# Altium schematic sheet Display.SchDoc
size A2
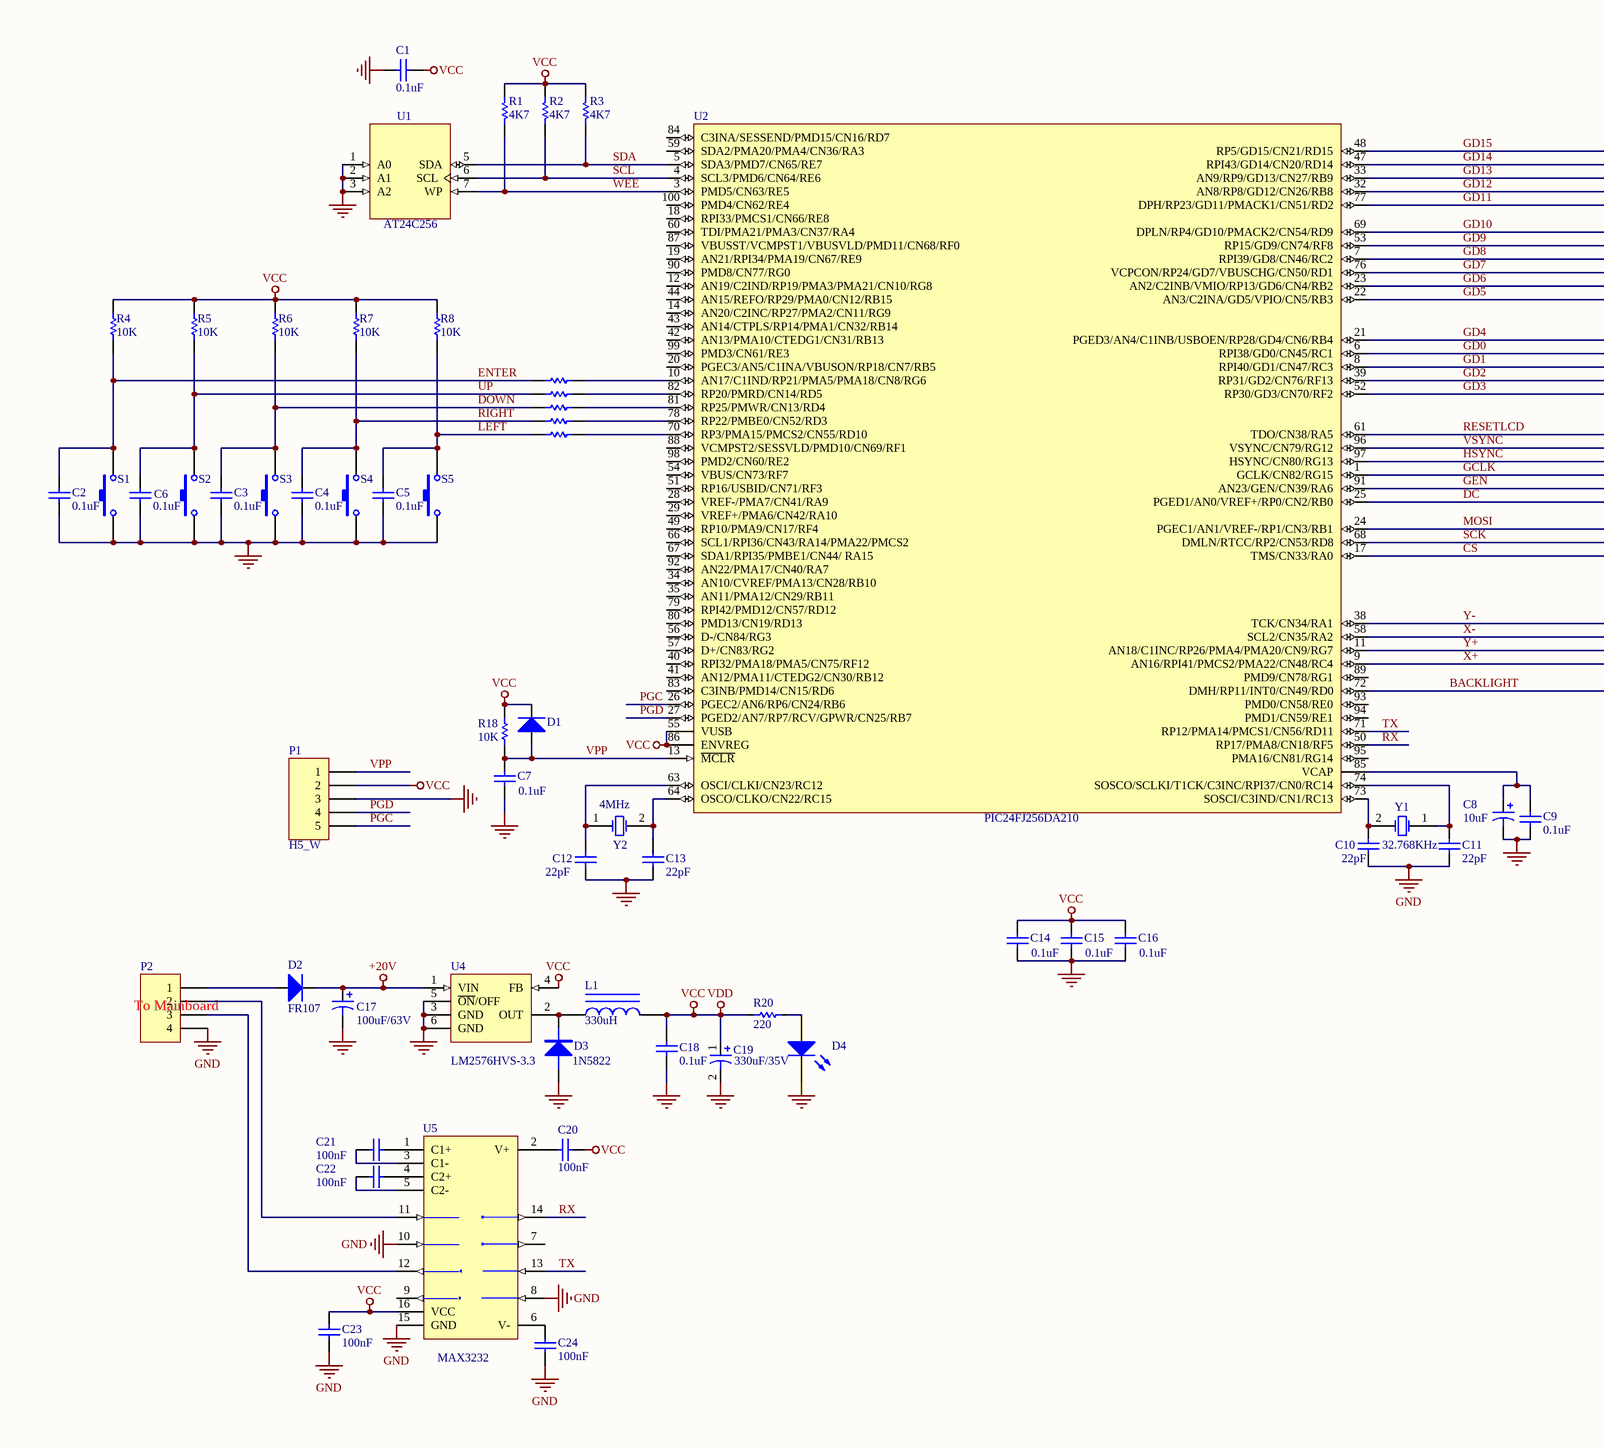
[diagram p0: Display.SchDoc, left]
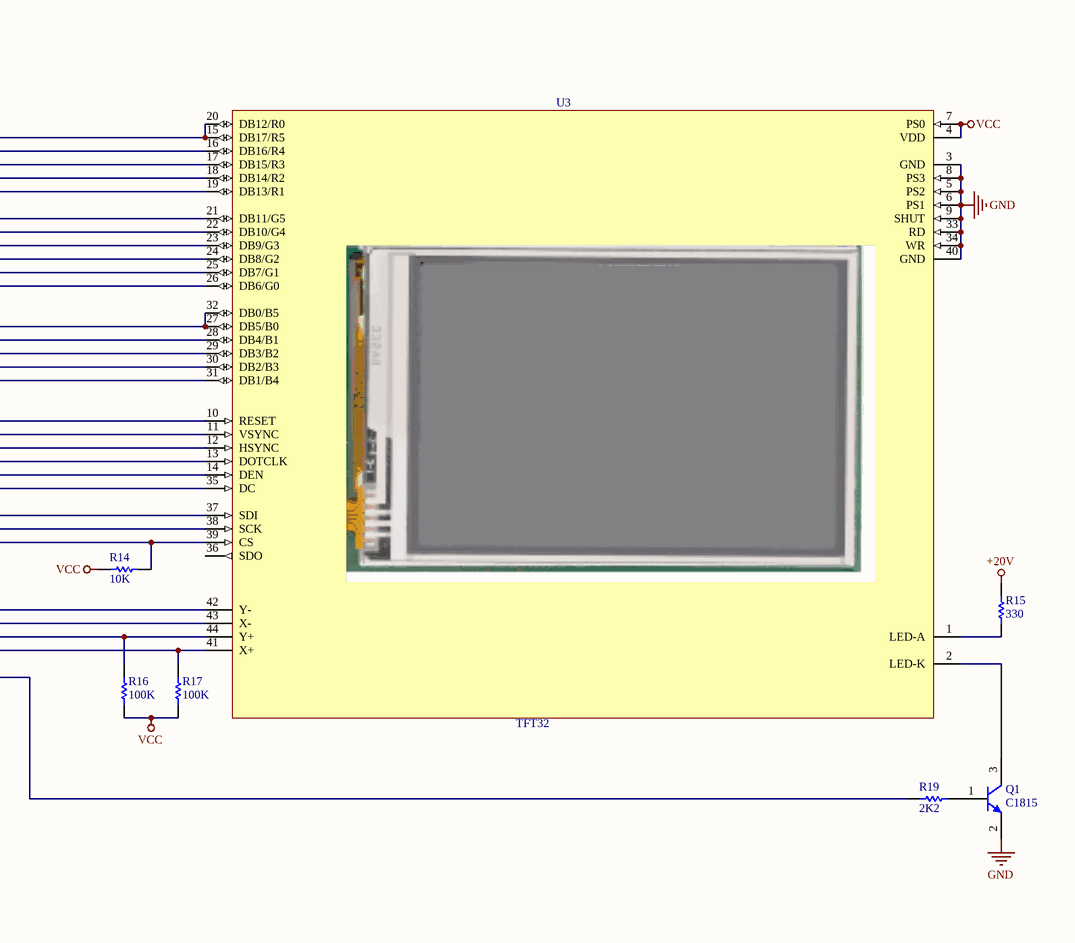
[diagram p1: Display.SchDoc, right]

## Parts
C1  0.1uF  [C1206]
C2  0.1uF  [C1206]
C3  0.1uF  [C1206]
C4  0.1uF  [C1206]
C5  0.1uF  [C1206]
C6  0.1uF  [C1206]
C7  0.1uF  [C1206]
C8  10uF  [C106-SMD]
C9  0.1uF  [C1206]
C10  22pF  [C0805]
C11  22pF  [C0805]
C12  22pF  [C0805]
C13  22pF  [C0805]
C14  0.1uF  [C1206]
C15  0.1uF  [C1206]
C16  0.1uF  [C1206]
C17  100uF/63V  [CAP-100UF/63V]
C18  value 0.1uF  [C1206]  (hidden comment: 104)
C19  330uF/35V  [CAP-100UF/63V]
C20  100nF  [C1206]
C21  100nF  [C1206]
C22  100nF  [C1206]
C23  100nF  [C1206]
C24  100nF  [C1206]
D1  1N4148  [1N4148-SMD]  (value not drawn)
D2  FR107  [DIODE-1A/300]
D3  1N5822  [FR307]
D4  LED  [LED-1206/100x100]  (value not drawn)
L1  330uH  [L-330uH]
P1  H5_W  [HEADER 5B]
P2  Header 4  [HEADER4X]  (value not drawn)
Q1  C1815  [SOT23A]
R1  4K7  [R0805]
R2  4K7  [R0805]
R3  4K7  [R0805]
R4  10K  [R0805]
R5  10K  [R0805]
R6  10K  [R0805]
R7  10K  [R0805]
R8  10K  [R0805]
R9  220  [R0805]  (value not drawn)
R10  220  [R0805]  (value not drawn)
R11  220  [R0805]  (value not drawn)
R12  220  [R0805]  (value not drawn)
R13  220  [R0805]  (value not drawn)
R14  10K  [R0805]
R15  330  [R1206]
R16  100K  [R0805]
R17  100K  [R0805]
R18  10K  [R0805]
R19  2K2  [R0805]
R20  220  [R0805]
S1  SW-PB  [BUTON-B3F]  (value not drawn)
S2  SW-PB  [BUTON-B3F]  (value not drawn)
S3  SW-PB  [BUTON-B3F]  (value not drawn)
S4  SW-PB  [BUTON-B3F]  (value not drawn)
S5  SW-PB  [BUTON-B3F]  (value not drawn)
U1  AT24C256  [8-SOIC_751]
U2  PIC24FJ256DA210  [TQFP-PT100_M]
U3  TFT32  [TFT-32]
U4  value LM2576HVS-3.3  [LM2576HVS-SMT]  (hidden comment: LM2576D2T-3.3)
U5  MAX3232  [NSO16_N]
Y1  32.768KHz  [XTA-32.768K]
Y2  4MHz  [XTA_SMD]

## Nets
+20V: C17.1 D2.2(K) R15.2 U4.1(VIN)
GND: C1.1 C2.1 C3.1 C4.1 C5.1 C6.1 C7.2 C8.2 C9.2 C10.1 C11.1 C12.1 C13.1 C14.2 C15.2 C16.2 C17.2 C18.1 C19.2 C23.2 C24.2 D3.1(A) D4.2(K) P1.3 P2.4 Q1.2(E) S1.1 S2.1 S3.1 S4.1 S5.1 U1.1(A0) U1.2(A1) U1.3(A2) U1.4(VSS) U2.15(VSS) U2.31(AVSS) U2.36(VSS) U2.45(VSS) U2.65(VSS) U2.75(VSS) U3.3(GND) U3.5(PS2) U3.6(PS1) U3.8(PS3) U3.9(SHUT) U3.33(RD) U3.34(WR) U3.40(GND) U4.3(GND) U4.5(~{ON}/OFF) U4.6(GND) U5.8(R2IN) U5.10(T2IN) U5.15(GND)
VCC: C1.2 C14.1 C15.1 C16.1 C18.2 C19.1 C20.2 C23.1 D1.2(K) L1.2 P1.2 R1.1 R2.1 R3.1 R4.2 R5.2 R6.2 R7.2 R8.2 R14.1 R16.1 R17.1 R18.1 R20.2 U1.8(VCC) U2.2(VDD) U2.16(VDD) U2.30(AVDD) U2.37(VDD) U2.46(VDD) U2.55(VUSB) U2.62(VDD) U2.86(ENVREG) U3.4(VDD) U3.7(PS0) U4.4(FB) U5.16(VCC)  [also labelled VDD]
BACKLIGHT: R19.2 U2.72(DMH/RP11/INT0/CN49/RD0)
CS: R14.2 U2.17(TMS/CN33/RA0) U3.39(CS)
DC: U2.25(PGED1/AN0/VREF+/RP0/CN2/RB0) U3.35(DC)
DOWN: C3.2 R6.1 R11.2 S3.2
ENTER: C2.2 R4.1 R9.2 S1.2
GCLK: U2.1(GCLK/CN82/RG15) U3.13(DOTCLK)
GD0: U2.6(RPI38/GD0/CN45/RC1) U3.28(DB4/B1)
GD1: U2.8(RPI40/GD1/CN47/RC3) U3.29(DB3/B2)
GD2: U2.39(RP31/GD2/CN76/RF13) U3.30(DB2/B3)
GD3: U2.52(RP30/GD3/CN70/RF2) U3.31(DB1/B4)
GD4: U2.21(PGED3/AN4/C1INB/USBOEN/RP28/GD4/CN6/RB4) U3.27(DB5/B0) U3.32(DB0/B5)
GD5: U2.22(AN3/C2INA/GD5/VPIO/CN5/RB3) U3.26(DB6/G0)
GD6: U2.23(AN2/C2INB/VMIO/RP13/GD6/CN4/RB2) U3.25(DB7/G1)
GD7: U2.76(VCPCON/RP24/GD7/VBUSCHG/CN50/RD1) U3.24(DB8/G2)
GD8: U2.7(RPI39/GD8/CN46/RC2) U3.23(DB9/G3)
GD9: U2.53(RP15/GD9/CN74/RF8) U3.22(DB10/G4)
GD10: U2.69(DPLN/RP4/GD10/PMACK2/CN54/RD9) U3.21(DB11/G5)
GD11: U2.77(DPH/RP23/GD11/PMACK1/CN51/RD2) U3.19(DB13/R1)
GD12: U2.32(AN8/RP8/GD12/CN26/RB8) U3.18(DB14/R2)
GD13: U2.33(AN9/RP9/GD13/CN27/RB9) U3.17(DB15/R3)
GD14: U2.47(RPI43/GD14/CN20/RD14) U3.16(DB16/R4)
GD15: U2.48(RP5/GD15/CN21/RD15) U3.15(DB17/R5) U3.20(DB12/R0)
GEN: U2.91(AN23/GEN/CN39/RA6) U3.14(DEN)
HSYNC: U2.97(HSYNC/CN80/RG13) U3.12(HSYNC)
LEFT: C5.2 R8.1 R13.2 S5.2
MOSI: U2.24(PGEC1/AN1/VREF-/RP1/CN3/RB1) U3.37(SDI)
PGC: P1.5 U2.26(PGEC2/AN6/RP6/CN24/RB6)
PGD: P1.4 U2.27(PGED2/AN7/RP7/RCV/GPWR/CN25/RB7)
RESETLCD: U2.61(TDO/CN38/RA5) U3.10(RESET)
RIGHT: C4.2 R7.1 R12.2 S4.2
RX: U2.50(RP17/PMA8/CN18/RF5) U5.14(T1OUT)
SCK: U2.68(DMLN/RTCC/RP2/CN53/RD8) U3.38(SCK)
SCL: R2.2 U1.6(SCL) U2.4(SCL3/PMD6/CN64/RE6)
SDA: R3.2 U1.5(SDA) U2.5(SDA3/PMD7/CN65/RE7)
TX: U2.71(RP12/PMA14/PMCS1/CN56/RD11) U5.13(R1IN)
UP: C6.2 R5.1 R10.2 S2.2
VPP: C7.1 D1.1(A) P1.1 R18.2 U2.13(~{MCLR})
VSYNC: U2.96(VSYNC/CN79/RG12) U3.11(VSYNC)
WEE: R1.2 U1.7(WP) U2.3(PMD5/CN63/RE5)
X+: R17.2 U2.9(AN16/RPI41/PMCS2/PMA22/CN48/RC4) U3.41(X+)
X-: U2.58(SCL2/CN35/RA2) U3.43(X-)
Y+: R16.2 U2.11(AN18/C1INC/RP26/PMA4/PMA20/CN9/RG7) U3.44(Y+)
Y-: U2.38(TCK/CN34/RA1) U3.42(Y-)
NetC8_1: C8.1 C9.1 U2.85(VCAP)
NetC10_2: C10.2 U2.73(SOSCI/C3IND/CN1/RC13) Y1.2(OSC2)
NetC11_2: C11.2 U2.74(SOSCO/SCLKI/T1CK/C3INC/RPI37/CN0/RC14) Y1.1(OSC1)
NetC12_2: C12.2 U2.63(OSCI/CLKI/CN23/RC12) Y2.1(OSC1)
NetC13_2: C13.2 U2.64(OSCO/CLKO/CN22/RC15) Y2.2(OSC2)
NetC20_1: C20.1 U5.2(V+)
NetC21_1: C21.1 U5.3(C1-)
NetC21_2: C21.2 U5.1(C1+)
NetC22_1: C22.1 U5.5(C2-)
NetC22_2: C22.2 U5.4(C2+)
NetC24_1: C24.1 U5.6(V-)
NetD2_1: D2.1(A) P2.1
NetD3_2: D3.2(K) L1.1 U4.2(OUT)
NetD4_1: D4.1(A) R20.1
NetP2_2: P2.2 U5.11(T1IN)
NetP2_3: P2.3 U5.12(R1OUT)
NetQ1_1: Q1.1(B) R19.1
NetQ1_3: Q1.3(C) U3.2(LED-K)
NetR9_1: R9.1 U2.10(AN17/C1IND/RP21/PMA5/PMA18/CN8/RG6)
NetR10_1: R10.1 U2.82(RP20/PMRD/CN14/RD5)
NetR11_1: R11.1 U2.81(RP25/PMWR/CN13/RD4)
NetR12_1: R12.1 U2.78(RP22/PMBE0/CN52/RD3)
NetR13_1: R13.1 U2.70(RP3/PMA15/PMCS2/CN55/RD10)
NetR15_1: R15.1 U3.1(LED-A)

Not connected (* = marked no-connect by the designer): U2 12(AN19/C2IND/RP19/PMA3/PMA21/CN10/RG8) 14(AN20/C2INC/RP27/PMA2/CN11/RG9) 18(RPI33/PMCS1/CN66/RE8) 19(AN21/RPI34/PMA19/CN67/RE9) 20(PGEC3/AN5/C1INA/VBUSON/RP18/CN7/RB5) 28(VREF-/PMA7/CN41/RA9) 29(VREF+/PMA6/CN42/RA10) 34(AN10/CVREF/PMA13/CN28/RB10) 35(AN11/PMA12/CN29/RB11) 40(RPI32/PMA18/PMA5/CN75/RF12) 41(AN12/PMA11/CTEDG2/CN30/RB12) 42(AN13/PMA10/CTEDG1/CN31/RB13) 43(AN14/CTPLS/RP14/PMA1/CN32/RB14) 44(AN15/REFO/RP29/PMA0/CN12/RB15) 49(RP10/PMA9/CN17/RF4) 51(RP16/USBID/CN71/RF3) 54(VBUS/CN73/RF7) 56(D-/CN84/RG3) 57(D+/CN83/RG2) 59(SDA2/PMA20/PMA4/CN36/RA3) 60(TDI/PMA21/PMA3/CN37/RA4) 66(SCL1/RPI36/CN43/RA14/PMA22/PMCS2) 67(SDA1/RPI35/PMBE1/CN44/_RA15) 79(RPI42/PMD12/CN57/RD12) 80(PMD13/CN19/RD13) 83(C3INB/PMD14/CN15/RD6) 84(C3INA/SESSEND/PMD15/CN16/RD7) 87(VBUSST/VCMPST1/VBUSVLD/PMD11/CN68/RF0) 88(VCMPST2/SESSVLD/PMD10/CN69/RF1) 89(PMD9/CN78/RG1) 90(PMD8/CN77/RG0) 92(AN22/PMA17/CN40/RA7) 93(PMD0/CN58/RE0) 94(PMD1/CN59/RE1) 95(PMA16/CN81/RG14) 98(PMD2/CN60/RE2) 99(PMD3/CN61/RE3) 100(PMD4/CN62/RE4); U3 36(SDO); U5 7(T2OUT) 9(R2OUT)

## Notes on the sheet
- (near P2) To Mainboard

## Library data of the parts
C1-C6 C10-C13 C18 = Cap: Capacitor; Manufacturer: Generic Components; Class: Passive; Published: 08/06/2000; Publisher: Altium Hobart Technology Centre; SubClass: Capacitor
  C1: Value: 0.1uF; NOTE: SMD 1206
  C2-C6: Value: 0.1uF
  C10-C13: Value: 22pF
C7 C9 C14-C16 = Cap: Capacitor; Published: 8-Jun-2000; LatestRevisionDate: 17-Jul-2002; LatestRevisionNote: Re-released for DXP Platform.; PackageReference: RAD-0.3; Publisher: Altium Limited; Value: 0.1uF; NOTE: SMD 1206
C8 = Cap Pol1: Polarized Capacitor (Radial); NOTE: TU TANTAN; Published: 8-Jun-2000; LatestRevisionDate: 17-Jul-2002; LatestRevisionNote: Re-released for DXP Platform.; PackageReference: RB7.6-15; Publisher: Altium Limited; Value: 10uF
C17 = Cap Pol1: Polarized Capacitor (Radial); Value: 100uF/63V SMD; Published: 8-Jun-2000; LatestRevisionDate: 17-Jul-2002; LatestRevisionNote: Re-released for DXP Platform.; PackageReference: RB7.6-15; Publisher: Altium Limited
C19 = Cap Pol1: Polarized Capacitor (Radial); Value: 330uF/35V SMD; Published: 8-Jun-2000; LatestRevisionDate: 17-Jul-2002; LatestRevisionNote: Re-released for DXP Platform.; PackageReference: RB7.6-15; Publisher: Altium Limited
C20-C24 = Cap: CAP CER .1UF 16V 10% X7R 0603; Part Number: GRM188R71C104KA01D; Manufacturer: Murata Electronics North America; Value: 100nF; Link: http://search.digikey.com/scripts/DkSearch/dksus.dll?Detail&name=490-1532-1-ND
D1 = Diode 1N4148: High Conductance Fast Diode; Value: 1N4148 SMD; Published: 8-Jun-2000; LatestRevisionDate: 17-Jul-2002; LatestRevisionNote: Re-released for DXP Platform.; DatasheetDocument: 1997; PackageReference: DO-35; Publisher: Altium Limited; Code_JEDEC: DO-204-AH; ComponentLink1Description: Manufacturer Link; ComponentLink1URL: http://www.fairchildsemi.com/; ComponentLink2Description: Datasheet; ComponentLink2URL: http://www.fairchildsemi.com/ds/1N%2F1N4148.pdf
D2 = Diode 1N4148: High Conductance Fast Diode; Published: 8-Jun-2000; LatestRevisionDate: 17-Jul-2002; LatestRevisionNote: Re-released for DXP Platform.; DatasheetDocument: 1997; PackageReference: DO-35; Publisher: Altium Limited; Code_JEDEC: DO-204-AH; ComponentLink1Description: Manufacturer Link; ComponentLink1URL: http://www.fairchildsemi.com/; ComponentLink2Description: Datasheet; ComponentLink2URL: http://www.fairchildsemi.com/ds/1N%2F1N4148.pdf; Value: FR107
D3 = DIODE: Value: 1N5822
D4 = LED0: Typical INFRARED GaAs LED; Published: 8-Jun-2000; LatestRevisionDate: 08-Jul-2005; LatestRevisionNote: Mech Layer 1 removed.; PackageReference: LED-0; Publisher: Altium Limited; Value: LED
L1 = Inductor Iron: Magnetic-Core Inductor; Manufacturer: Generic Components; Class: Passive; Published: 1999; SubClass: Inductor; Value: 330uH
P1 = Header 5: Header, 5-Pin; LatestRevisionDate: 17-Jul-2002; LatestRevisionNote: Re-released for DXP Platform.; Publisher: Altium Limited; Value: H5_W
P2 = Header 4: Header, 4-Pin; LatestRevisionDate: 17-Jul-2002; LatestRevisionNote: Re-released for DXP Platform.; Publisher: Altium Limited; Value: Header 4
Q1 = NPN: NPN Bipolar Transistor; NOTE: SMD; Published: 8-Jun-2000; LatestRevisionDate: 17-Jul-2002; LatestRevisionNote: Re-released for DXP Platform.; PackageReference: TO-226; Publisher: Altium Limited; Code_JEDEC: TO-226-AA; Value: C1815
R1-R18 = Res1: Resistor; Manufacturer: Generic Components; Class: Passive; Published: 08/06/2000; Publisher: Altium Hobart Technology Centre; SubClass: Resistor
  R1-R3: Value: 4K7; NOTE: SMD 1206
  R4-R8 R14 R18: Value: 10K
  R9-R13: Value: 220
  R15: Value: 330
  R16 R17: Value: 100K
R19 R20 = Res1: Resistor; Published: 8-Jun-2000; LatestRevisionDate: 17-Jul-2002; LatestRevisionNote: Re-released for DXP Platform.; PackageReference: AXIAL-0.3; Publisher: Altium Limited
  R19: Value: 2K2
  R20: Value: 220
S1-S5 = SW-PB: Switch; Value: SW-CHIP; Published: 24-Mar-1999; LatestRevisionDate: 17-Jul-2002; LatestRevisionNote: Re-released for DXP Platform.; PackageReference: SPST-2; Publisher: Altium Limited
U1 = 24AA1025-I/SM: 1 Mbit, 400kHz, 1.7V, I2C Serial EEPROM, 8-Pin SOIC 208mil, Industrial Temperature; Published: 29-Jan-2009; DatasheetVersion: revE, Mar-2007; PackageVersion: revAW, Oct-2008; PackageReference: SOIJ-SM8; Publisher: Altium Limited; PackageDescription: 8-Lead Plastic Small Outline (SM) - Medium, 5.28 mm Body [SOIJ]; ComponentLink1Description: Manufacturer Link; ComponentLink1URL: http://www.microchip.com; ComponentLink2Description: Datasheet; ComponentLink2URL: http://ww1.microchip.com/downloads/en/DeviceDoc/21941E.pdf; ComponentLink3Description: Packaging Specification; ComponentLink3URL: http://ww1.microchip.com/downloads/en/PackagingSpec/00049AW.pdf; Value: AT24C256
U2 = PIC24FJ256DA210: Graphic Controller; Value: PIC24FJ256DA210
U3 = TFT32: LCD TFT 3.2 inch with touch screen; Value: TFT2N0369-E
U4 = LM2576D2T-3.3: Easy Switcher 3.0A Step-Down Voltage Regulator; Note: Pin 3 is electrically connected to Pin 6;Pin 6 is heatsink; Published: 15-Apr-2002; DatasheetVersion: Jul-1999; PackageVersion: Jul-1999; PackageReference: 936A-02; Publisher: Altium Limited; PackageDescription: D2-PAK; 5 Leads; Body 14.7 (inc. leads) x 10.2 mm (LxW max); ComponentLink1Description: Manufacturer Link; ComponentLink1URL: http://www.onsemi.com/site/products/taxonomy/0,4438,503,00.html; ComponentLink2Description: Datasheet; ComponentLink2URL: http://www.onsemi.com/pub/Collateral/LM2576-D.PDF
U5 = MAX3232CSE: 3.0V TO 5.5V, Low-Power, up to 1Mbps, True RS-232 Transceiver Using Four 0.1µF External Capacitor; Part Number: MAX3232ECDWR; Manufacturer: Texas Instruments; Value: MAX3232; Link: http://search.digikey.com/scripts/DkSearch/dksus.dll?Detail&name=296-19852-1-ND
Y1 = XTAL: Crystal Oscillator; Manufacturer: Generic Components; Published: 08/06/2000; Publisher: Altium Hobart Technology Centre; Class: Oscillator; SubClass: Crystal Oscillator; Value: 32.768KHz
Y2 = XTAL: Crystal Oscillator; Published: 8-Jun-2000; LatestRevisionDate: 17-Jul-2002; LatestRevisionNote: Re-released for DXP Platform.; PackageReference: R38; Publisher: Altium Limited; Value: 4MHz